# Altium project PCB_GateWay_ESP32.PrjPcb
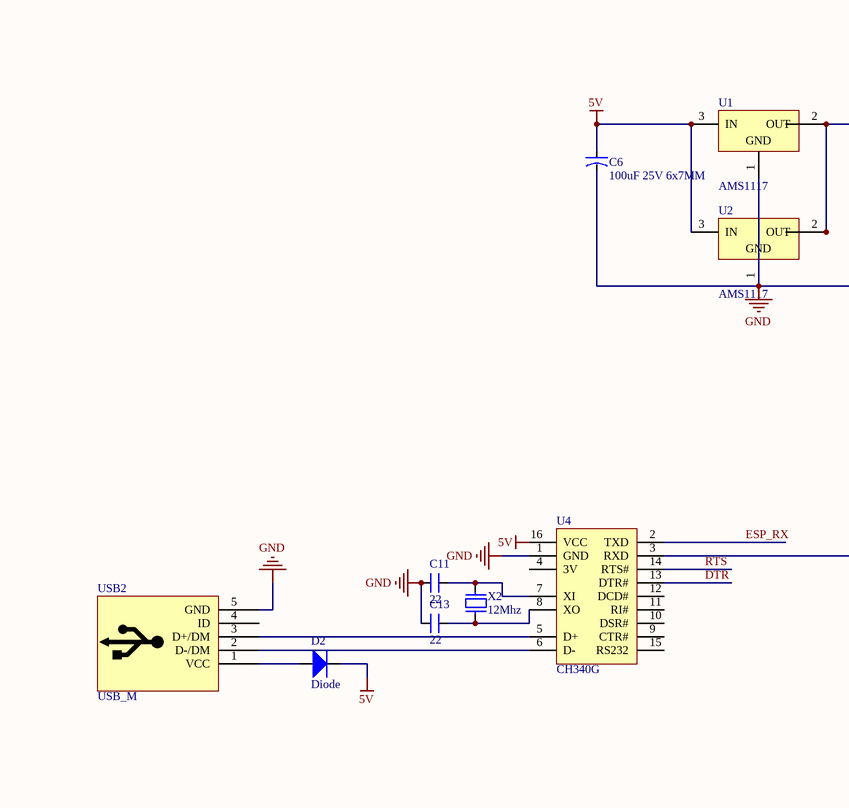
[diagram p0: GatewayESP32.SchDoc, top left]
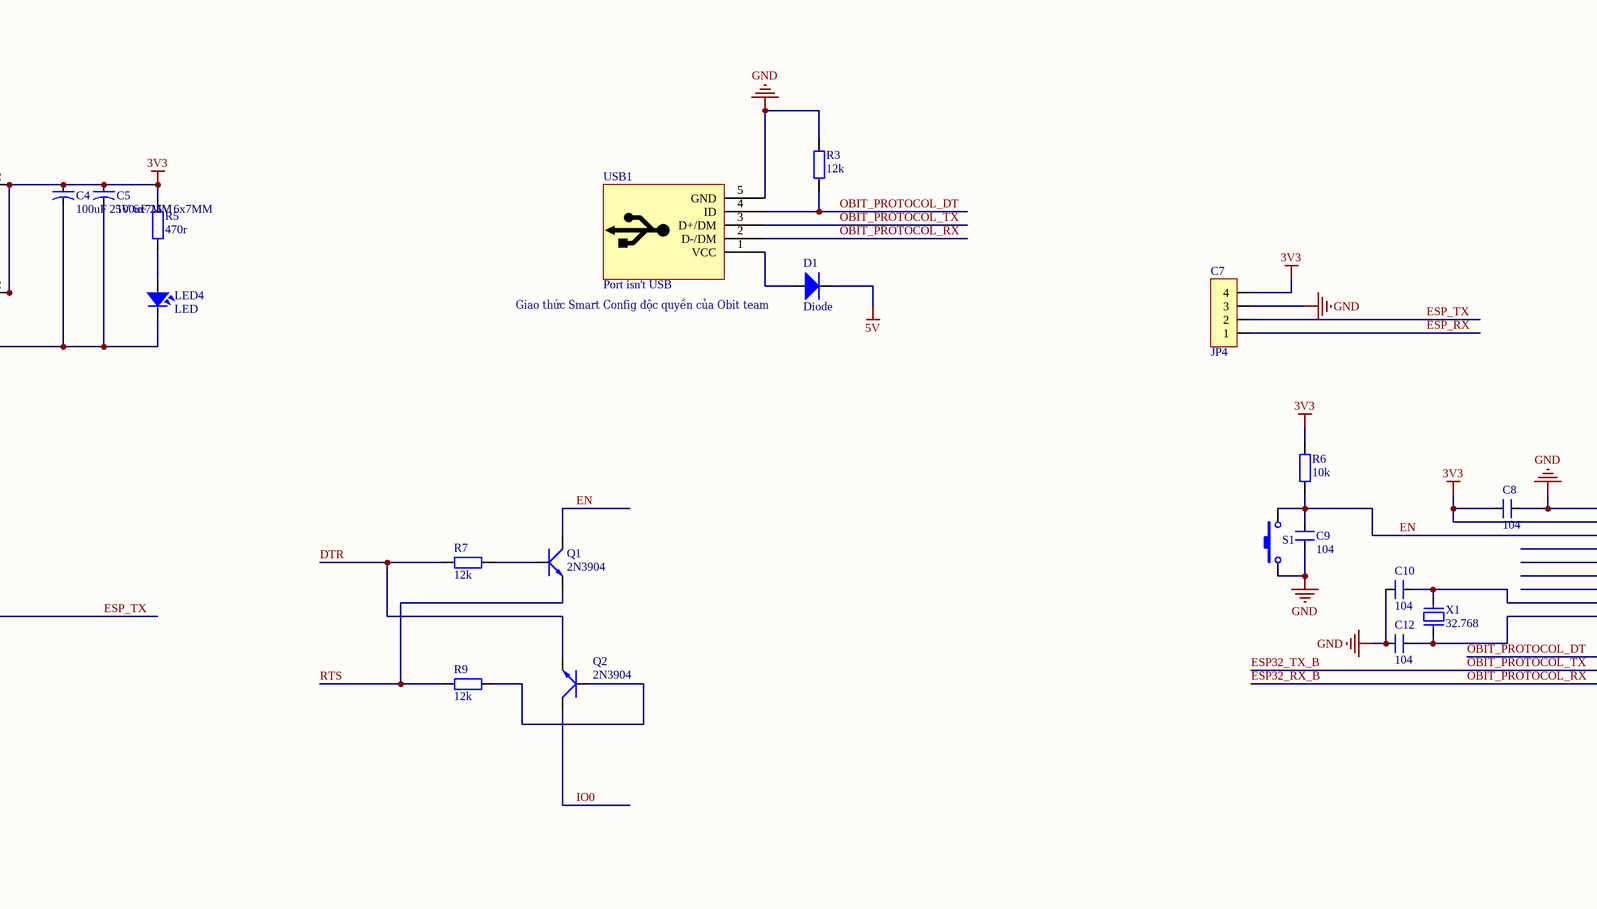
[diagram p1: GatewayESP32.SchDoc, top middle]
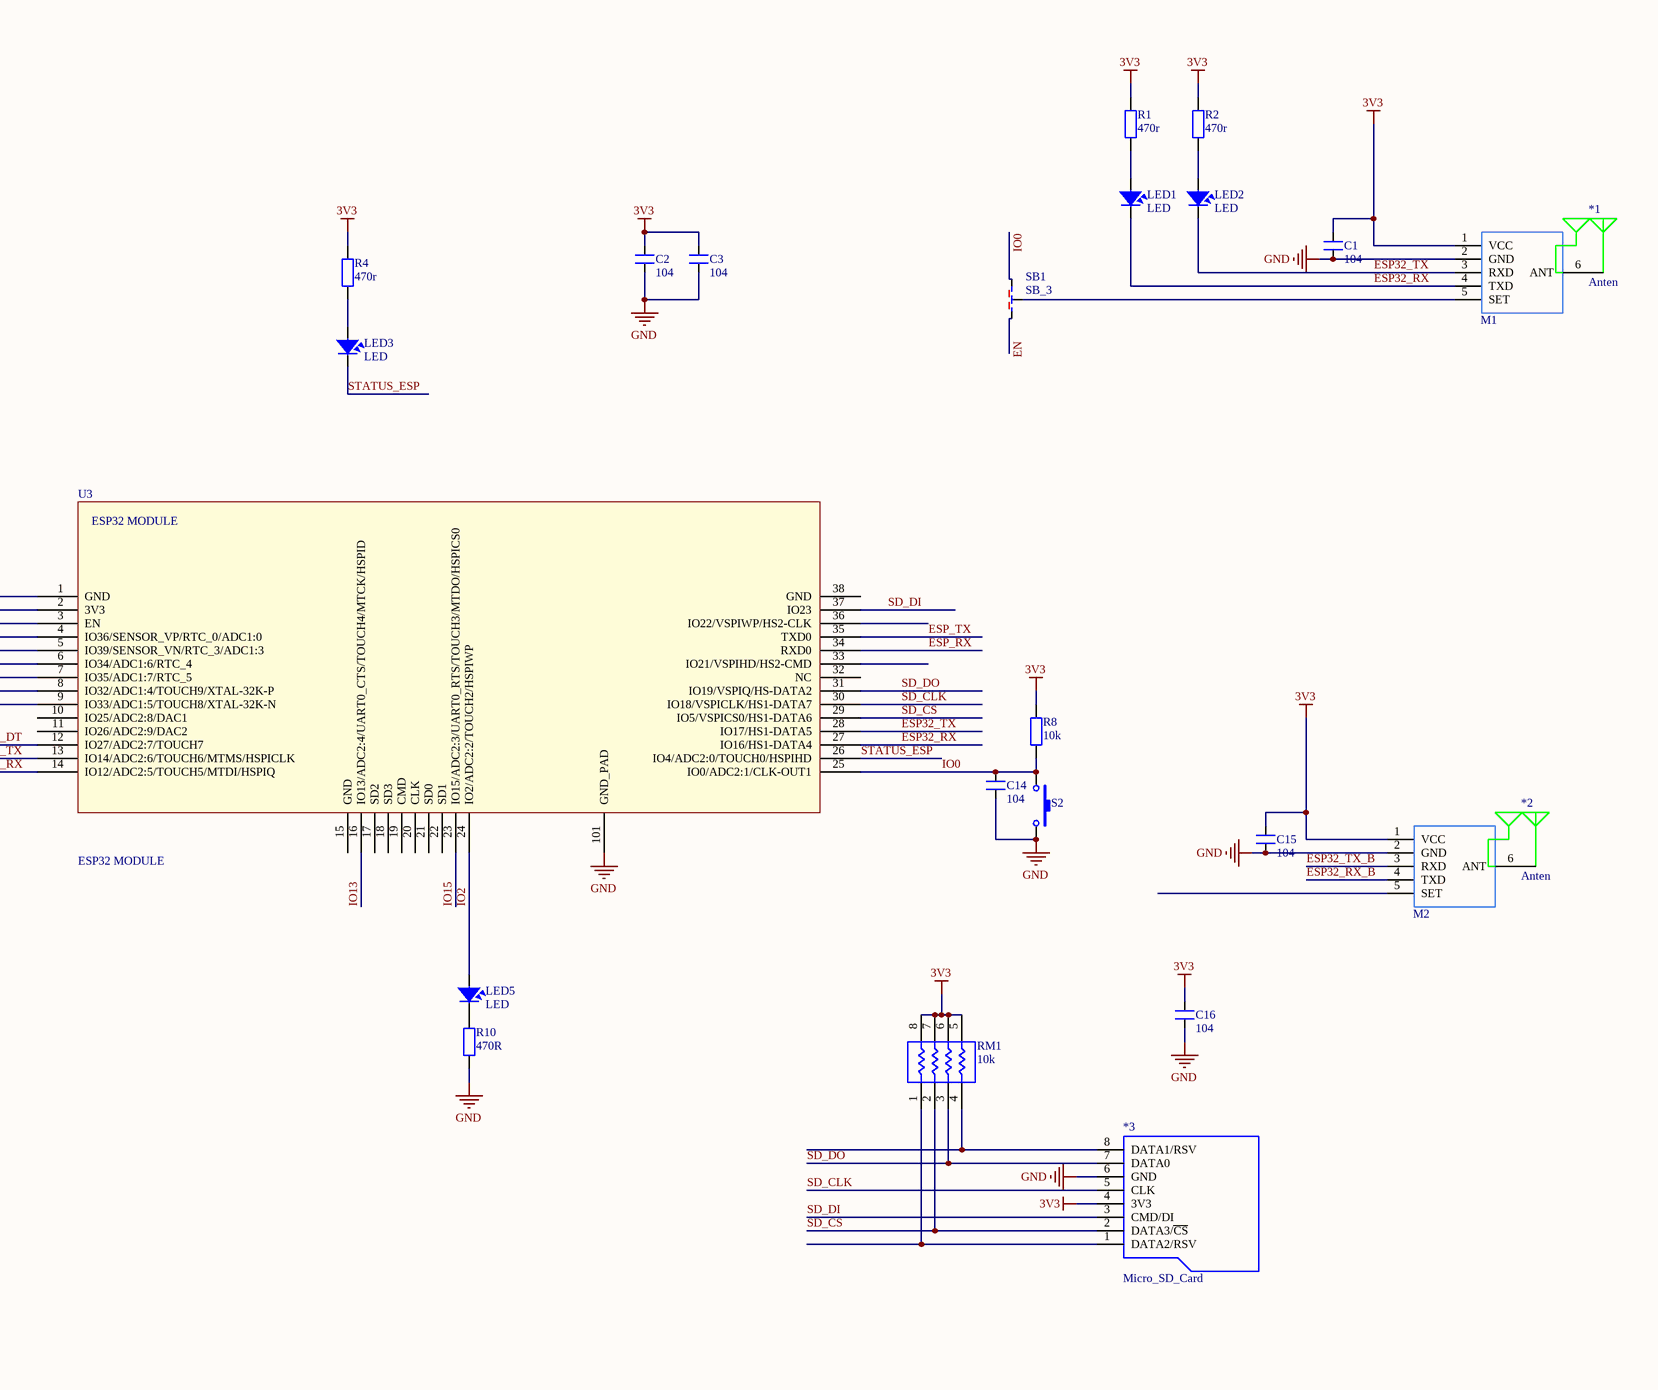
[diagram p2: GatewayESP32.SchDoc, top right]
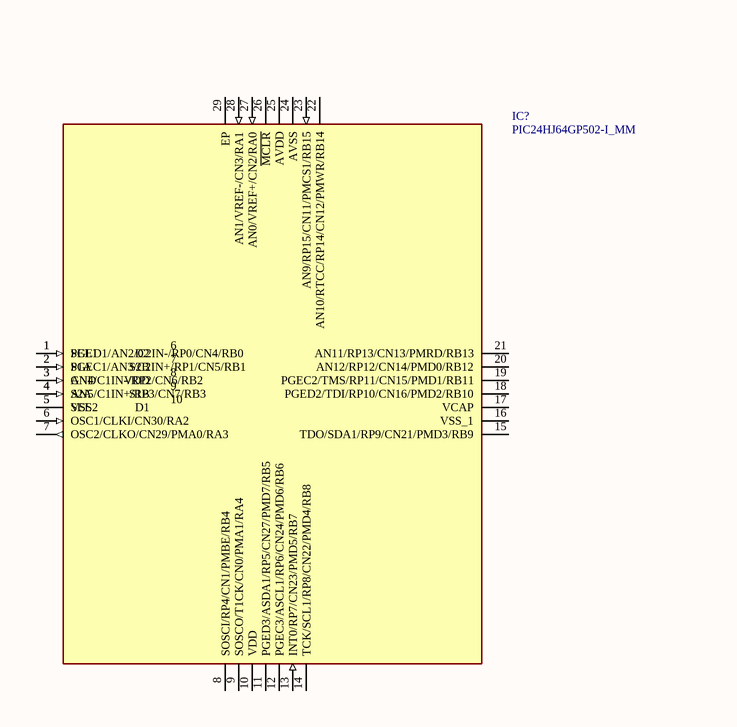
[diagram p3: GatewayESP32.SchDoc, bottom left]
1 sheet, 54 parts. Net scope: global (net labels, ports and power ports of the same name join across sheets).
Board file: GatewayESP32.PcbDoc

## Sheet GatewayESP32.SchDoc
size A0

### Parts
(Parts that share a designator on the sheet are numbered #1, #2 ... from top to bottom, then left to right.)
*1  Anten  [LOXO_433_NGANG]
*2  Anten  [LOXO_433_NGANG]
*3  Micro_SD_Card  [Micro_SD_Card]
C1  104  [SM-0805]
C2  104  [SM-0805]
C3  104  [SM-0805]
C4  100uF 25V 6x7MM  [CAP-ALU-SMD-6.3x7.7x2.2]
C5  100uF 25V 6x7MM  [CAP-ALU-SMD-6.3x7.7x2.2]
C6  100uF 25V 6x7MM  [CAP-ALU-SMD-6.3x7.7x2.2]
C7  JP4  [JP4-C1T]
C8  104  [SM-0805]
C9  104  [SM-0805]
C10  104  [SM-0805]
C11  22  [SM-0805]
C12  104  [SM-0805]
C13  22  [SM-0805]
C14  104  [SM-0805]
C15  104  [SM-0805]
C16  104  [SM-0805]
D1  Diode  [DIO-SMD-106]
D2  Diode  [DIO-SMD-106]
IC?#1  TMUX1136DGSR  [SOP50P490X110-10N]
IC?#2  PIC24HJ64GP502-I_MM  [QFN65P600X600X100-29N-D]
LED1  LED  [SM-LED-0805-Blue]
LED2  LED  [SM-LED-0805-Blue]
LED3  LED  [SM-LED-0805-Blue]
LED4  LED  [SM-LED-0805-Blue]
LED5  LED  [SM-LED-0805-Blue]
M1  CC1101  [CC1101 UART HC11]  (value not drawn)
M2  CC1101  [CC1101 UART HC11]  (value not drawn)
Q1  2N3904  [SOT23-231]
Q2  2N3904  [SOT23-231]
R1  470r  [RES-SMD-0805]
R2  470r  [RES-SMD-0805]
R3  12k  [RES-SMD-0805]
R4  470r  [RES-SMD-0805]
R5  470r  [RES-SMD-0805]
R6  10k  [RES-SMD-0805]
R7  12k  [RES-SMD-0805]
R8  10k  [RES-SMD-0805]
R9  12k  [RES-SMD-0805]
R10  470R  [RES-SMD-0805]
RM1  10k  [RN4-0805]
S1  SW  [BUTTON-SMD 2PIN]  (value not drawn)
S2  SW  [BUTTON-SMD 2PIN]  (value not drawn)
SB1  SB_3  [SB_3]
U1  AMS1117  [SOT223]
U2  AMS1117  [SOT223]
U3  ESP32 MODULE  [ESP32S]
U4  CH340G  [SO16]
USB1  Port isn't USB  [USB-M1]
USB2  USB_M  [USB-M1]
X1  32.768  [XT32k]
X2  12Mhz  [XT2]

### Nets
3V3: *3.4(3V3) C1.2 C2.2 C3.2 C4.1 C5.1 C7.4 C8.2 C15.2 C16.1 M1.1(VCC) M2.1(VCC) R1.2 R2.2 R4.2 R5.2 R6.2 R8.1 RM1.5 RM1.6 RM1.7 RM1.8 U1.2(OUT) U1.4 U2.2(OUT) U2.4 U3.2(3V3)
5V: C6.1 D1.2 D2.2 U1.3(IN) U2.3(IN) U4.16(VCC)
GND: *3.6(GND) C1.1 C2.1 C3.1 C4.2 C5.2 C6.2 C7.3 C8.1 C9.2 C10.2 C11.2 C12.2 C13.2 C14.1 C15.1 C16.2 LED4.2 M1.2(GND) M2.2(GND) R3.1 R10.2 S1.1 S2.2 U1.1(GND) U2.1(GND) U3.1(GND) U3.101(GND_PAD) U4.1(GND) USB1.5(GND) USB2.5(GND)
DTR: Q2.1(E) R7.2 U4.13(DTR#)
EN: C9.1 Q1.3(C) R6.1 S1.2 SB1.1 U3.3(EN)
ESP32_RX: LED1.2 M1.4(TXD) U3.27(IO16/HS1-DATA4)
ESP32_RX_B: M2.4(TXD) U3.14(IO12/ADC2:5/TOUCH5/MTDI/HSPIQ) USB1.2(D-/DM)  [also labelled OBIT_PROTOCOL_RX]
ESP32_TX: LED2.2 M1.3(RXD) U3.28(IO17/HS1-DATA5)
ESP32_TX_B: M2.3(RXD) U3.13(IO14/ADC2:6/TOUCH6/MTMS/HSPICLK) USB1.3(D+/DM)  [also labelled OBIT_PROTOCOL_TX]
ESP_RX: C7.1 U3.34(RXD0) U4.2(TXD)
ESP_TX: C7.2 U3.35(TXD0) U4.3(RXD)
IO0: C14.2 Q2.3(C) R8.2 S2.1 SB1.3 U3.25(IO0/ADC2:1/CLK-OUT1)
IO2: LED5.1 U3.24(IO2/ADC2:2/TOUCH2/HSPIWP)
IO13: U3.16(IO13/ADC2:4/UART0_CTS/TOUCH4/MTCK/HSPID)
IO15: U3.23(IO15/ADC2:3/UART0_RTS/TOUCH3/MTDO/HSPICS0)
OBIT_PROTOCOL_DT: R3.2 U3.12(IO27/ADC2:7/TOUCH7) USB1.4(ID)
RTS: Q1.1(E) R9.2 U4.14(RTS#)
SD_CLK: *3.5(CLK) U3.30(IO18/VSPICLK/HS1-DATA7)
SD_CS: *3.2(DATA3/~{CS}) RM1.2 U3.29(IO5/VSPICS0/HS1-DATA6)
SD_DI: *3.3(CMD/DI) U3.37(IO23)
SD_DO: *3.7(DATA0) RM1.3 U3.31(IO19/VSPIQ/HS-DATA2)
STATUS_ESP: LED3.2 U3.26(IO4/ADC2:0/TOUCH0/HSPIHD)
Net*1_1: *1.1 M1.6(ANT)
Net*2_1: *2.1 M2.6(ANT)
Net*3_1: *3.1(DATA2/RSV) RM1.1
Net*3_8: *3.8(DATA1/RSV) RM1.4
NetC10_1: C10.1 U3.8(IO32/ADC1:4/TOUCH9/XTAL-32K-P) X1.2
NetC11_1: C11.1 U4.7(XI) X2.2
NetC12_1: C12.1 U3.9(IO33/ADC1:5/TOUCH8/XTAL-32K-N) X1.1
NetC13_1: C13.1 U4.8(XO) X2.1
NetD1_1: D1.1 USB1.1(VCC)
NetD2_1: D2.1 USB2.1(VCC)
NetIC?#1_1: IC?#1.1(SEL1) IC?#2.1(PGED1/AN2/C2IN-/RP0/CN4/RB0)
NetIC?#1_2: IC?#1.2(S1A) IC?#2.2(PGEC1/AN3/C2IN+/RP1/CN5/RB1)
NetIC?#1_3: IC?#1.3(GND) IC?#2.3(AN4/C1IN-/RP2/CN6/RB2)
NetIC?#1_4: IC?#1.4(S2A) IC?#2.4(AN5/C1IN+/RP3/CN7/RB3)
NetIC?#1_5: IC?#1.5(SEL2) IC?#2.5(VSS)
NetLED1_1: LED1.1 R1.1
NetLED2_1: LED2.1 R2.1
NetLED3_1: LED3.1 R4.1
NetLED4_1: LED4.1 R5.1
NetLED5_2: LED5.2 R10.1
NetM1_5: M1.5(SET) SB1.2
NetQ1_2: Q1.2(B) R7.1
NetQ2_2: Q2.2(B) R9.1
NetU4_5: U4.5(D+) USB2.3(D+/DM)
NetU4_6: U4.6(D-) USB2.2(D-/DM)

Not connected (* = marked no-connect by the designer): IC?#1 6(D2) 7(S2B) 8(VDD) 9(S1B) 10(D1); IC?#2 6(OSC1/CLKI/CN30/RA2) 7(OSC2/CLKO/CN29/PMA0/RA3) 8(SOSCI/RP4/CN1/PMBE/RB4) 9(SOSCO/T1CK/CN0/PMA1/RA4) 10(VDD) 11(PGED3/ASDA1/RP5/CN27/PMD7/RB5) 12(PGEC3/ASCL1/RP6/CN24/PMD6/RB6) 13(INT0/RP7/CN23/PMD5/RB7) 14(TCK/SCL1/RP8/CN22/PMD4/RB8) 15(TDO/SDA1/RP9/CN21/PMD3/RB9) 16(VSS_1) 17(VCAP) 18(PGED2/TDI/RP10/CN16/PMD2/RB10) 19(PGEC2/TMS/RP11/CN15/PMD1/RB11) 20(AN12/RP12/CN14/PMD0/RB12) 21(AN11/RP13/CN13/PMRD/RB13) 22(AN10/RTCC/RP14/CN12/PMWR/RB14) 23(AN9/RP15/CN11/PMCS1/RB15) 24(AVSS) 25(AVDD) 26(~{MCLR}) 27(AN0/VREF+/CN2/RA0) 28(AN1/VREF-/CN3/RA1) 29(EP); M2 5(SET); U3 4(IO36/SENSOR_VP/RTC_0/ADC1:0) 5(IO39/SENSOR_VN/RTC_3/ADC1:3) 6(IO34/ADC1:6/RTC_4) 7(IO35/ADC1:7/RTC_5) 10(IO25/ADC2:8/DAC1) 11(IO26/ADC2:9/DAC2) 15(GND) 17(SD2) 18(SD3) 19(CMD) 20(CLK) 21(SD0) 22(SD1) 32(NC) 33(IO21/VSPIHD/HS2-CMD) 36(IO22/VSPIWP/HS2-CLK) 38(GND); U4 4(3V) 9(CTR#) 10(DSR#) 11(RI#) 12(DCD#) 15(RS232); USB2 4(ID)

### Notes on the sheet
- (near D1) Giao thức Smart Config độc quyền của Obit team

### Library data of the parts
C1-C3 C8-C16 = CM: Cap SMD; Value: 103
C4-C6 = CN-ALU-SMD: Polarized Capacitor (Axial); Published: 8-Jun-2000; LatestRevisionDate: 17-Jul-2002; LatestRevisionNote: Re-released for DXP Platform.; PackageReference: POLAR0.8; Publisher: Altium Limited
C7 = JP4: WR-PHD 2.54 mm Angled Socket Header; Manufacturer: W¨¹rth Elektronik eiSos GmbH; partNo: 613004143121; ComponentLink1 Description: Manufacturer; ComponentLink2 Description: Datasheet; NoPins: 04; Created Date: 29 March 2013; ComponentLink1URL: http://www.we-online.com; ComponentLink2URL: http://katalog.we-online.de/em/datasheet/6130xx143121.pdf; Created by: Karrer Zheng
IC?#1 = TMUX1136DGSR: Integrated Circuit; Manufacturer_Name: Texas Instruments; Datasheet Link: http://www.ti.com/lit/gpn/TMUX1136; Height: 1.1mm; Manufacturer_Part_Number: TMUX1136DGSR; Mouser Part Number: 595-TMUX1136DGSR; Mouser Price/Stock: https://www.mouser.com/Search/Refine.aspx?Keyword=595-TMUX1136DGSR
IC?#2 = PIC24HJ64GP502-I_MM: Integrated Circuit; Manufacturer_Name: Microchip; Manufacturer_Part_Number: PIC24HJ64GP502-I/MM; Allied_Number: 70414075; Datasheet Link: http://docs-emea.rs-online.com/webdocs/0cf4/0900766b80cf43e1.pdf; Height: 1mm; Mouser Part Number: 579-PIC24J64GP502IMM; Mouser Price/Stock: https://www.mouser.com/Search/Refine.aspx?Keyword=579-PIC24J64GP502IMM; RS Part Number: 6669605; RS Price/Stock: https://uk.rs-online.com/web/p/products/6669605; Allied Price/Stock: http://www.alliedelec.com/microchip-technology-inc-pic24hj64gp502-i-mm/70414075/
M1 M2 = CC1101 UART HC11: OBIT TEAM / CC1101 UART 433MHZ
Q1 Q2 = 2N3904: NPN 600mW, ECB; Value: C1815
R1-R10 = R: Resistor R1/4W
RM1 = ResPack
S1 S2 = SW-Button: Switch-Button; Published: 24-Mar-1999; LatestRevisionDate: 17-Jul-2002; LatestRevisionNote: Re-released for DXP Platform.; PackageReference: SPST-2; Publisher: Altium Limited
U1 U2 = AMS117
U4 = CH340G: High and Low Side Driver; Note: Pins 4, 8 and 14 are not connected; Published: 8-Jun-2000; LatestRevisionDate: 04-Mar-2005; LatestRevisionNote: Stylized 3D Model Added.; DatasheetVersion: PD60147J; PackageReference: PDIP14; Publisher: Altium Limited; PackageDescription: DIP; 14 Leads; Row Spacing 7.62 mm; Pitch 2.54 mm; ComponentLink1Description: Manufacturer Link; ComponentLink1URL: http://www.irf.com/; ComponentLink2Description: Datasheet; ComponentLink2URL: http://www.irf.com/product-info/datasheets/data/ir2110.pdf
USB1 = USB_M
X1 X2 = XT2: Crystal, 32.768 KHz, -40 to 85 degC, 3.2 x 1.5 x 0.9 mm SMD; Value: 4Mhz